# EAGLE design EPS32THINGY (EAGLE 9.5.2)
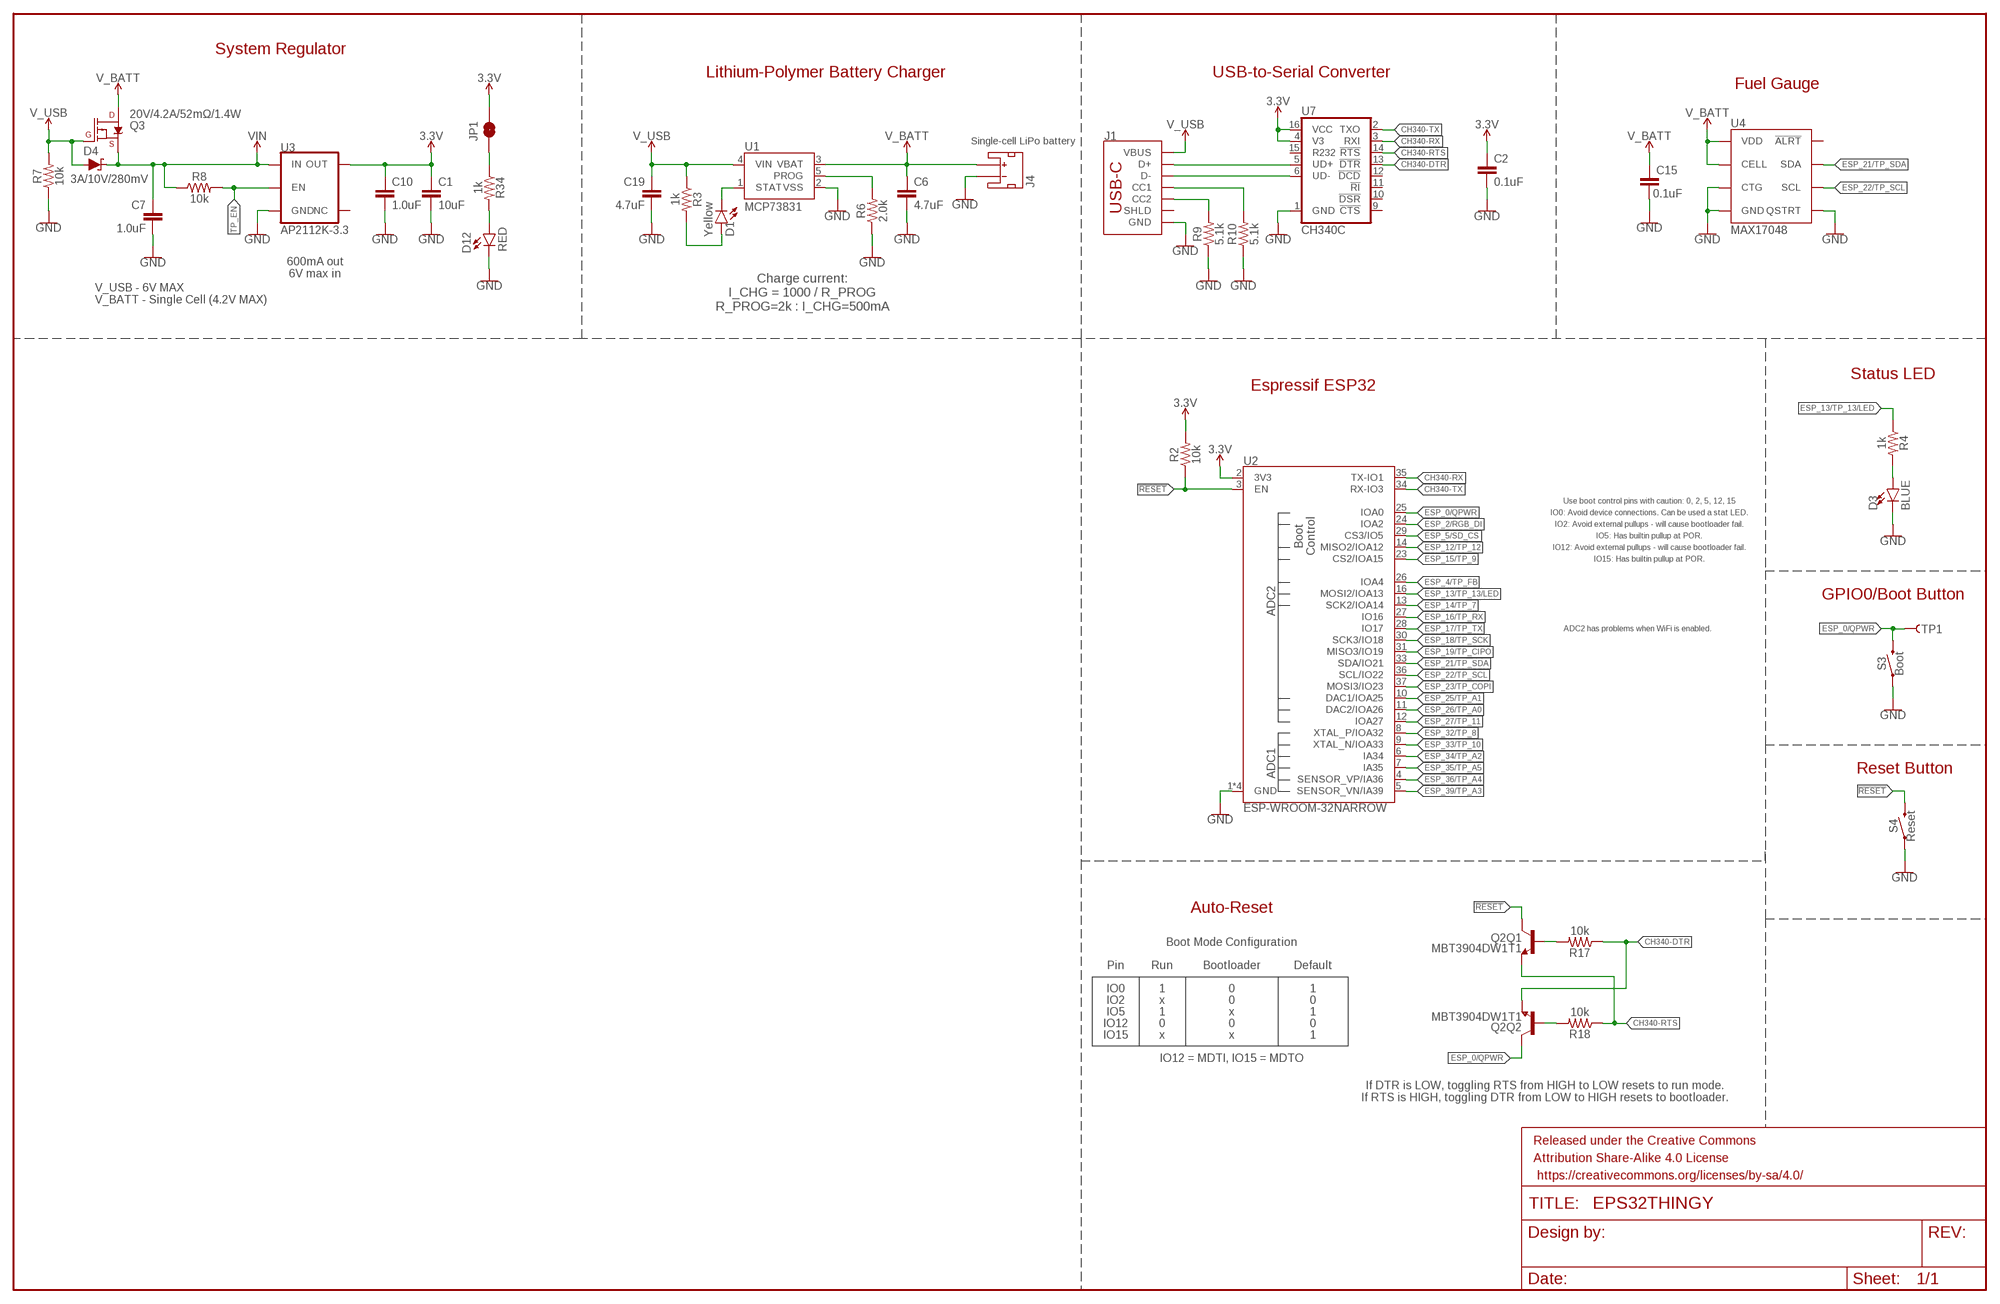
[diagram p0: schematic, sheet 1]

## Parts
C1  10uF  10UF-0402T-6.3V-20%  [0402-TIGHT]
C2  0.1uF  0.1UF-0402T-6.3V-10%-X7R  [0402-TIGHT]
C6  4.7uF  4.7UF-0402_TIGHT-6.3V-20%-X5R  [0402-TIGHT]
C7  1.0uF  1.0UF-0402T-16V-10%  [0402-TIGHT]
C10  1.0uF  1.0UF-0402T-16V-10%  [0402-TIGHT]
C15  0.1uF  0.1UF-0402T-16V-10%  [0402-TIGHT]
C19  4.7uF  4.7UF-0603-35V-(20%)  [0603]
D1  Yellow  LED-YELLOW0603  [LED-0603]
D3  BLUE  LED-BLUE0603  [LED-0603]
D4  3A/10V/280mV  DIODE-SCHOTTKY-BAT60A  [SOD-323]
D12  RED  LED-RED0603  [LED-0603]
FRAME1  FRAME-LEDGER  [CREATIVE_COMMONS]
J1  USB_C_2-LAYER_PADS  [USB-C-16P-2LAYER-PADS]
J4  JST_2MM_MALE  [JST-2-SMD]
JP1  JUMPER-SMT_2_NC_TRACE_SILK  [SMT-JUMPER_2_NC_TRACE_SILK]
Q2  MBT3904DW1T1  TRANS_NPN_DUAL-MBT3904DW1T1  [SC70-6]
Q3  20V/4.2A/52mΩ/1.4W  MOSFET_PCH-DMG2305UX-7  [SOT23-3]
R2  10k  10KOHM-0402T-1/16W-1%  [0402-TIGHT]
R3  1k  1KOHM-0402T-1/16W-1%  [0402-TIGHT]
R4  1k  1KOHM-0402T-1/16W-1%  [0402-TIGHT]
R6  2.0k  2.0KOHM-0603-1/10W-5%  [0603]
R7  10k  10KOHM-0402T-1/16W-1%  [0402-TIGHT]
R8  10k  10KOHM-0402T-1/16W-1%  [0402-TIGHT]
R9  5.1k  5.1KOHM-0402T-1/16W-1%  [0402-TIGHT]
R10  5.1k  5.1KOHM-0402T-1/16W-1%  [0402-TIGHT]
R17  10k  10KOHM-0402T-1/16W-1%  [0402-TIGHT]
R18  10k  10KOHM-0402T-1/16W-1%  [0402-TIGHT]
R34  1k  1KOHM-0402T-1/16W-1%  [0402-TIGHT]
S3  Boot  MOMENTARY-SWITCH-SPST-SMD-4.6X2.8MM  [TACTILE_SWITCH_SMD_4.6X2.8MM]
S4  Reset  MOMENTARY-SWITCH-SPST-SMD-4.6X2.8MM  [TACTILE_SWITCH_SMD_4.6X2.8MM]
TP1  TEST-POINT3X5  [PAD.03X.05]
U1  MCP73831  [SOT23-5]
U2  ESP-WROOM-32NARROW  [ESP-WROOM-32-NARROW]
U3  AP2112K-3.3  V_REG_AP2112K-3.3V  [SOT23-5]
U4  MAX17048  MAX17048DFN8  [DFN-8]
U7  CH340C  [SO016]

## Nets
3.3V [power]: C1.1 C2.1 C10.1 JP1.2 R2.2 U2.2(3V3) U3.5(OUT) U7.4(V3) U7.16(VCC)
!RESET!: Q2.3(Q1:C) R2.1 S4.3 S4.4 U2.3(EN)
CH340-DTR: Q2.1(Q2:E) R17.1 U7.13(!DTR)
CH340-RTS: Q2.4(Q1:E) R18.1 U7.14(!RTS)
CH340-RX: U2.35(TX-IO1) U7.3(RXI)
CH340-TX: U2.34(RX-IO3) U7.2(TXO)
CHG: D1.C U1.1(STAT)
CHG_LED: D1.A R3.2
D+: J1.A6(D+) J1.B6(D+) U7.5(UD+)
D-: J1.A7(D-) J1.B7(D-) U7.6(UD-)
DTR-10K: Q2.5(Q1:B) R17.2
ESP_0/QPWR: Q2.6(Q2:C) S3.3 S3.4 TP1.P$1 U2.25(IOA0)
ESP_2/RGB_DI: U2.24(IOA2)
ESP_4/TP_FB: U2.26(IOA4)
ESP_5/SD_CS: U2.29(CS3/IO5)
ESP_12/TP_12: U2.14(MISO2/IOA12)
ESP_13/TP_13/LED: R4.1 U2.16(MOSI2/IOA13)
ESP_14/TP_7: U2.13(SCK2/IOA14)
ESP_15/TP_9: U2.23(CS2/IOA15)
ESP_16/TP_RX: U2.27(IO16)
ESP_17/TP_TX: U2.28(IO17)
ESP_18/TP_SCK: U2.30(SCK3/IO18)
ESP_19/TP_CIPO: U2.31(MISO3/IO19)
ESP_21/TP_SDA: U2.33(SDA/IO21) U4.8(SDA)
ESP_22/TP_SCL: U2.36(SCL/IO22) U4.7(SCL)
ESP_23/TP_COPI: U2.37(MOSI3/IO23)
ESP_25/TP_A1: U2.10(DAC1/IOA25)
ESP_26/TP_A0: U2.11(DAC2/IOA26)
ESP_27/TP_11: U2.12(IOA27)
ESP_32/TP_8: U2.8(XTAL_P/IOA32)
ESP_33/TP_10: U2.9(XTAL_N/IOA33)
ESP_34/TP_A2: U2.6(IA34)
ESP_35/TP_A5: U2.7(IA35)
ESP_36/TP_A4: U2.4(SENSOR_VP/IA36)
ESP_39/TP_A3: U2.5(SENSOR_VN/IA39)
GND: C1.2 C2.2 C6.2 C7.2 C10.2 C15.2 C19.2 D3.C D12.C J1.GND J1.GND2(GND) J4.1(-) R6.1 R7.1 R9.1 R10.1 S3.1 S3.2 S4.1 S4.2 U1.2(VSS) U2.1(GND) U2.15(GND) U2.38(GND) U2.GND U3.2(GND) U4.1(CTG) U4.4(GND) U4.6(QSTRT) U4.9(GND) U7.1(GND)
N$1: JP1.1 R34.1
N$2: D3.A R4.2
N$5: J1.B5(CC2) R9.2
N$6: J1.A5(CC1) R10.2
N$14: R6.2 U1.5(PROG)
N$30: D12.A R34.2
RTS-10K: Q2.2(Q2:B) R18.2
TP_EN: R8.2 U3.3(EN)
V_BATT [power]: C6.1 C15.1 J4.2(+) Q3.3(D) U1.3(VBAT) U4.2(CELL) U4.3(VDD)
V_USB [power]: C19.1 D4.A J1.VBUS1(VBUS) J1.VBUS2(VBUS) Q3.1(G) R3.1 R7.2 U1.4(VIN)
VIN [power]: C7.1 D4.C Q3.2(S) R8.1 U3.1(IN)
Unconnected: J1.SHLD1(SHLD) J1.SHLD2(SHLD) J1.SHLD3(SHLD) J1.SHLD4(SHLD) J4.NC1(PAD1) J4.NC2(PAD2) U3.4(NC) U4.5(!ALRT) U7.9(!CTS) U7.10(!DSR) U7.11(!RI) U7.12(!DCD) U7.15(R232)

## Notes on the sheet
- System Regulator
- Lithium-Polymer Battery Charger | USB-to-Serial Converter
- Fuel Gauge
- Single-cell LiPo battery
- 600mA out
  6V max in
- Charge current:
  I_CHG = 1000 / R_PROG
  R_PROG=2k : I_CHG=500mA
- V_USB - 6V MAX
  V_BATT - Single Cell (4.2V MAX)
- Status LED
- Espressif ESP32
- Use boot control pins with caution: 0, 2, 5, 12, 15
- IO0: Avoid device connections. Can be used a stat LED.
- IO2: Avoid external pullups - will cause bootloader fail.
- IO5: Has builtin pullup at POR.
- IO12: Avoid external pullups - will cause bootloader fail.
- IO15: Has builtin pullup at POR.
- GPIO0/Boot Button
- ADC2 has problems when WiFi is enabled.
- Reset Button
- Auto-Reset
- Boot Mode Configuration
- Pin | Run | Bootloader | Default
- IO0 | 1 | 0 | 1
- IO2 | x | 0 | 0
- IO5 | 1 | x | 1
- IO12 | 0 | 0 | 0
- IO15 | x | x | 1
- IO12 = MDTI, IO15 = MDTO
- If DTR is LOW, toggling RTS from HIGH to LOW resets to run mode.
  If RTS is HIGH, toggling DTR from LOW to HIGH resets to bootloader.

## Library data of the parts
C1 = SparkFun-Capacitors:10UF: 10.0µF ceramic capacitors A capacitor is a passive two-terminal electrical component used to store electrical energy temporarily in an electric field.; PROD_ID: CAP-14848
C2 = SparkFun-Capacitors:0.1UF: 0.1µF ceramic capacitors A capacitor is a passive two-terminal electrical component used to store electrical energy temporarily in an electric field.; PROD_ID: CAP-14993
C6 = SparkFun-Capacitors:4.7UF: 4.7µF ceramic capacitors A capacitor is a passive two-terminal electrical component used to store electrical energy temporarily in an electric field.; PROD_ID: CAP-14240
C7 C10 = SparkFun-Capacitors:1.0UF: 1µF ceramic capacitors A capacitor is a passive two-terminal electrical component used to store electrical energy temporarily in an electric field.; PROD_ID: CAP-12417
C15 = SparkFun-Capacitors:0.1UF: 0.1µF ceramic capacitors A capacitor is a passive two-terminal electrical component used to store electrical energy temporarily in an electric field.; PROD_ID: CAP-12416
C19 = SparkFun-Capacitors:4.7UF: 4.7µF ceramic capacitors A capacitor is a passive two-terminal electrical component used to store electrical energy temporarily in an electric field.; PROD_ID: CAP-14106
D1 = SparkFun-LED:LED-YELLOW: Yellow SMD LED Used in manufacturing several products at SparkFun. Packages: 0603 - SMD 0603 package[Product Link] <http://www.kingbrightusa.com/product.asp?catalog_name=LED&product_id=APT1608SYCK> 0603 -SMART - SMART SMD 0603 package (more efficient/more expensive) [Product Link] <http://www.osram-os.com/osram_os/en/products/product-catalog/led-light-emitting-diodes/smartled-0603/ly-l29k/index.jsp> LilyPad - SMD1206 package[Product Datasheet] <https://www.sparkfun.com/datasheets/DevTools/LilyPad/Q150YUS4.pdf> SparkFun Products: Blynk Board <https://www.sparkfun.com/products/13794> IOIO-OTG <https://www.sparkfun.com/products/13613> XBee Explorer Serial <https://www.sparkfun.com/products/13225>; PROD_ID: DIO-09003
D3 = SparkFun-LED:LED-BLUE: Blue SMD LED Used in manufacturing of various products at SparkFun Packages: 0603 - SMD 0603 package [Product Link] <http://www.digikey.com/product-detail/en/SMLE12BC7TT86/511-1589-2-ND/1641808> 1206 - SMD1206 package [Product Link] <http://www.digikey.com/product-detail/en/lite-on-inc/LTST-C150TBKT/160-1643-1-ND/573584> SparkFun Products: ESP8266 Thing-Dev Board <https://www.sparkfun.com/products/13711> RedBoard <https://www.sparkfun.com/products/12757>; PROD_ID: DIO-08575
D4 = SparkFun-DiscreteSemi:DIODE-SCHOTTKY: Schottky diode A Schottky diode is a semiconductor diode which has a low forward voltage drop and a very fast switching action.; PROD_ID: DIO-14072
D12 = SparkFun-LED:LED-RED: Red SMD LED Used in manufacturing of most products at SparkFun Packages: 0603 - SMD 0603 package [Product Link] <http://docs.avagotech.com/docs/AV02-0551EN> 0603 SMART - SMD 0603 SMART package ( more efficient and expensive)[Product Link] <http://www.osram-os.com/Graphics/XPic2/00077099_0.pdf> 1206 - SMD1206 package [Product Link] <https://www.sparkfun.com/datasheets/DevTools/LilyPad/Q150OVS4.pdff> SparkFun Products: Pro Mini 328 -5V <https://www.sparkfun.com/products/821> RedBoard <https://www.sparkfun.com/products/12757> IOIO-OTG <https://www.sparkfun.com/products/13613>; PROD_ID: DIO-00819
FRAME1 = SparkFun-Aesthetics:FRAME-LEDGER: Schematic Frame - Ledger Standard 11x14 US Ledger frame
J1 = SparkFun-Connectors:USB_C: USB Type C 16Pin Connector Super Speed pins not available on the 16-pin purely SMD connector so this part is best for USB 2.0 implementations. D1 and D2 are tied together enabling D+/- no matter which way the cable is plugged into the connector. The two channel configuration pins (CC1/2) are exposed. These are normally connected to ground via 5.1k resistors but can be reconfigured for high current/high power applications. **4-LAYER BOARD WARNING!!** If designing 4-layer board, make sure to select the variant _4-LAYER-ISOLATED. The linked footprint (USB-C-16-4LAYER-ISOLATED) includes some very necessary cutout polygons in the inner layers (2 and 15). This prevents the PTH mounting shield legs on the USB connector from electrically connecting any other polygons on the inner layers (usually VCC and GND).; PROD_ID: CONN-14122
J4 = SparkFun-Connectors:JST_2MM_MALE: JST 2MM MALE RA CONNECTOR Two pin, compact surface mount connector. Commonly used as a battery input connection point. We really like the solid locking feeling and high current rating on these small connectors. We use these all the time as battery connectors. Mates to single-cell LiPo batteries. Here is the connector we sell at SparkFun: JST Right Angle Connector - White <https://www.sparkfun.com/products/8612> (PRT-08612) Datasheet <http://www.sparkfun.com/datasheets/Prototyping/Connectors/JST-Horizontal.pdf> It was used on these SparkFun products: SparkFun MOSFET Power Controller <https://www.sparkfun.com/products/11214> (PRT-11214) SparkFun Battery Babysitter - LiPo Battery Manager <https://www.sparkfun.com/products/13777> (PRT-13777) And many, many others that required a lipo battery connection.; PROD_ID: CONN-11443; SF_ID: PRT-08612
JP1 = SparkFun-Jumpers:JUMPER-SMT_2_NC_TRACE: Normally closed trace jumper This jumper has a trace between two pads so it's normally closed (NC). Use a razor knife to open the connection. For best results follow the IPC guidelines for cutting traces: Cutout at least 0.063 mm (0.005 in). Remove all loose material to clean up the cut area. Seal the cut with an approved epoxy. Reapply solder to reclose the connection.
Q2 = SparkFun-DiscreteSemi:TRANS_NPN_DUAL: Dual NPN Transistors in Single Package The MBT3904W1 puts two general purpose 3904 NPN transistors in a single package. Datasheet <http://www.onsemi.com/pub_link/Collateral/MBT3904DW1T1-D.PDF> SparkFun Products: SparkFun ESP32 Thing <https://www.sparkfun.com/products/13907>; PROD_ID: TRANS-13337
Q3 = SparkFun-DiscreteSemi:MOSFET_PCH: P-channel MOSFETs Voltage controlled devices that allow control of high current outputs. SparkFun Products: SparkFun ESP32 Thing <https://www.sparkfun.com/products/13907> SparkFun ESP8266 Thing <https://www.sparkfun.com/products/13231> SparkFun Pi Servo HAT V2 <https://www.sparkfun.com/products/15316> DMG2305UX-7 (20V/4.2A/SOT23-3); PROD_ID: TRAN-14388
R2 R7 R8 R17 R18 = SparkFun-Resistors:10KOHM: 10kΩ resistor A resistor is a passive two-terminal electrical component that implements electrical resistance as a circuit element. Resistors act to reduce current flow, and, at the same time, act to lower voltage levels within circuits. - Wikipedia; PROD_ID: RES-14241
R3 R4 R34 = SparkFun-Resistors:1KOHM: 1kΩ resistor A resistor is a passive two-terminal electrical component that implements electrical resistance as a circuit element. Resistors act to reduce current flow, and, at the same time, act to lower voltage levels within circuits. - Wikipedia; PROD_ID: RES-14342
R6 = SparkFun-Resistors:2.0KOHM: 2kΩ resistor A resistor is a passive two-terminal electrical component that implements electrical resistance as a circuit element. Resistors act to reduce current flow, and, at the same time, act to lower voltage levels within circuits. - Wikipedia; PROD_ID: RES-08296
R9 R10 = SparkFun-Resistors:5.1KOHM; PROD_ID: RES-14340
S3 S4 = SparkFun-Switches:MOMENTARY-SWITCH-SPST: Momentary Switch (Pushbutton) - SPST Normally-open (NO) SPST momentary switches (buttons, pushbuttons). Variants PTH-12MM - 12mm square, through-hole Momentary Pushbutton Switch - 12mm Square <https://www.sparkfun.com/products/9190> (COM-09190) PTH-6.0MM, PTH-6.0MM-KIT - 6.0mm square, through-hole Mini Pushbutton Switch <https://www.sparkfun.com/products/97> (COM-00097) KIT package intended for soldering kit's - only one side of pads' copper is exposed. PTH-RIGHT-ANGLE-KIT - Right-angle, through-hole Right Angle Tactile Button <https://www.sparkfun.com/products/10791> - Used on SparkFun BigTime Watch Kit <https://www.sparkfun.com/products/11734> SMD-12MM - 12mm square, surface-mount Tactile Button - SMD (12mm) <https://www.sparkfun.com/products/12993> (COM-12993) Used on SparkFun PicoBoard <https://www.sparkfun.com/products/11888> SMD-4.5MM - 4.5mm Square Trackball Switch Used on SparkFun Blackberry Trackballer Breakout <https://www.sparkfun.com/products/13169> SMD-4.6MMX2.8MM - 4.60mm x 2.80mm, surface mount Used on SparkFun SAMD21 Mini Breakout <https://www.sparkfun.com/products/13664> SMD-5.2MM, SMD-5.2-REDUNDANT - 5.2mm square, surface-mount Mini Pushbutton Switch - SMD <https://www.sparkfun.com/products/8720> (COM-08720) Used on Arduino Pro Mini <https://www.sparkfun.com/products/11114> REDUNDANT package connects both switch circuits together SMD-6.0X3.5MM - 6.0 x 3.5mm, surface mount Momentary Reset Switch SMD <https://www.sparkfun.com/products/8229> (COM-08229) SMD-6.2MM-TALL - 6.2mm square, surface mount Tactile Button - SMD (6mm) <https://www.sparkfun.com/products/12992> Used on SparkFun Digital Sandbox <https://www.sparkfun.com/products/12651> SMD-RIGHT-ANGLE - Right-angle, surface mount Used on SparkFun Block for Intel® Edison - Arduino <https://www.sparkfun.com/products/13036>; PROD_ID: SWCH-15606
TP1 = SparkFun-Connectors:TEST-POINT: SparkFun Test Points Bare copper test points for troubleshooting or In-Circuit-Testing. These are used by our Production team for verifying production board runs using pogo-pins on test beds. SparkFun Products: SparkFun LSM9DS1 Breakout <https://www.sparkfun.com/products/13284> SparkFun PSOC <https://www.sparkfun.com/products/13714> SparkFun Load Cell Amplifier <https://www.sparkfun.com/products/13879>
U1 = SparkFun-PowerIC:MCP73831: Miniature single cell, fully integrated Li-Ion, Li-polymer charge management controller http://ww1.microchip.com/downloads/en/DeviceDoc/20001984g.pdf IC-09995; PROD_ID: IC-09995
U2 = SparkFun-RF:ESP-WROOM-32; PROD_ID: IC-13849
U3 = SparkFun-IC-Power:V_REG_AP2112: AP2112 - 600mA CMOS LDO Regulator w/ Enable The AP2112 is CMOS process low dropout linear regulator with enable function, the regulator delivers a guaranteed 600mA (min.) continuous load current. Features Output Voltage Accuracy: ±1.5% Output Current: 600mA (Min.) Foldback Short Current Protection: 50mA Enable Function to Turn ON/OFF VOUT Low Dropout Voltage (3.3V): 250mV (Typ.) @IOUT=600mA Excellent Load Regulation: 0.2%/A (Typ.) Excellent Line Regulation: 0.02%/V (Typ.) Low Quiescent Current: 55μA (Typ.) Low Standby Current: 0.01μA (Typ.) Low Output Noise: 50μVRMS PSRR: 100Hz -65dB, 1kHz -65dB OTSD Protection Stable with 1.0μF Flexible Cap: Ceramic, Tantalum and Aluminum Electrolytic Operation Temperature Range: -40°C to 85°C ESD: MM 400V, HBM 4000V; PROD_ID: VREG-12457; VALUE: 3.3V
U4 = SparkFun-IC-Power:MAX17048: Micropower 1-Cell Li+ ModelGauge SparkFun Products Qduino Mini <https://www.sparkfun.com/products/13614> (DEV-13614); PROD_ID: IC-12551
U7 = SparkFun-IC-Comms:CH340C; PROD_ID: IC-14038

## Net classes
0 default: width 0.127 mm, drill 0.305 mm
1 power: width 0.305 mm, drill 0.305 mm

## Board
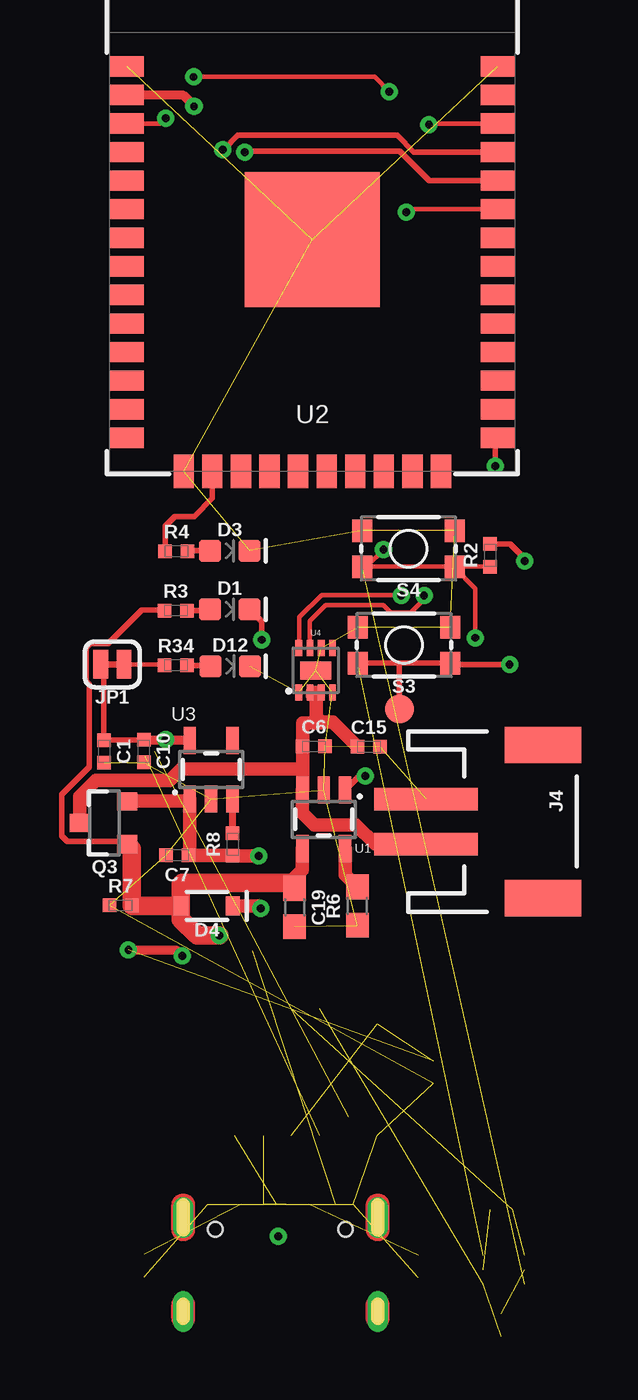
[diagram p1: board, top side]
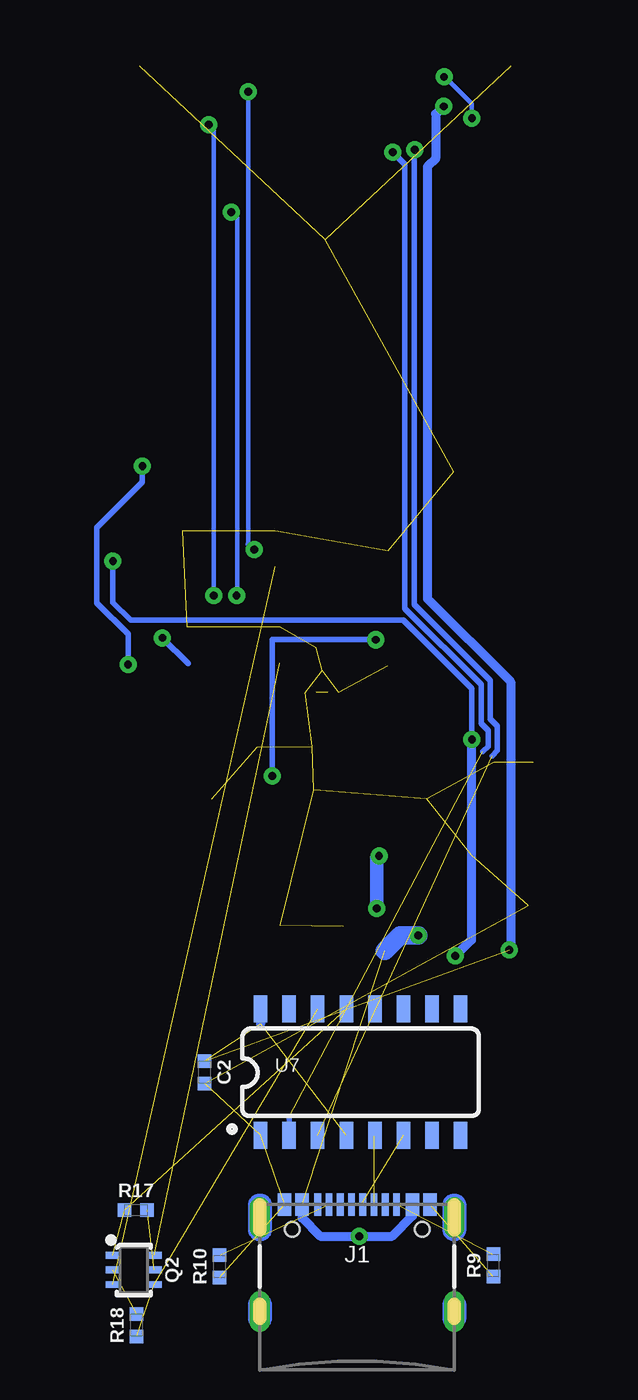
[diagram p2: board, bottom side, seen from below]

No outline drawn. Coordinates in mm, seen from the top.
Copper layers (1*16): Top 0.035mm / dielectric 1.5mm / Bottom 0.035mm
Design rules "LionCircuits *": minimum track width 6mil, minimum drill 0.35mm, track to track 6mil, track to pad 6mil, pad to pad 6mil, via to via 8mil, smd to smd 8mil, copper to edge 30mil, drill to drill 10mil, minimum pad ring 10mil, minimum via ring 8mil, stop-mask expansion 4mil, vias tented up to drill 0mil, thermal gap 10mil

### Footprints (pad centres in the part's own frame; a part is rotated, then mirrored left to right if it is on the bottom)
0402-TIGHT = smd 0.6 x 0.6: 1 -0.5,0; 2 0.5,0
0603 = smd 1.1 x 1: 1 -0.85,0; 2 0.85,0
LED-0603 = smd 1 x 1: A -0.877,0; C 0.877,0
SOD-323 = smd 0.63 x 0.83: A 1.15,0; C -1.15,0
USB-C-16P-2LAYER-PADS = smd 0.3 x 1: A5 -1.25,-0.34; A6 -0.25,-0.34; A7 0.25,-0.34; A8 1.25,-0.34; B5 1.75,-0.34; B6 0.75,-0.34; B7 -0.75,-0.34; B8 -1.75,-0.34 | smd 0.6 x 1: GND -3.225,-0.34; GND2 3.225,-0.34; VBUS1 -2.45,-0.34; VBUS2 2.45,-0.34 | drill 0.4 pad 0.6 long: SHLD1 -4.318,-0.915; SHLD2 4.318,-0.915; SHLD3 -4.318,-5.095; SHLD4 4.318,-5.095 | hole 0.65: -2.89,-1.445; 2.89,-1.445
JST-2-SMD = smd 1 x 4.6: 1 -1,-3.7; 2 1,-3.7 | smd 1.6 x 3.4: NC1 -3.4,1.5; NC2 3.4,1.5
SMT-JUMPER_2_NC_TRACE_SILK = smd 0.66 x 1.27: 1 -0.521,0; 2 0.521,0
SC70-6 = smd 0.3 x 0.66: 1 -0.65,-0.92; 2 0,-0.92; 3 0.65,-0.92; 4 0.65,0.92; 5 0,0.92; 6 -0.65,0.92
SOT23-3 = smd 0.8 x 0.9: 1 -0.95,-1; 2 0.95,-1; 3 0,1.1
TACTILE_SWITCH_SMD_4.6X2.8MM = smd 0.9 x 1: 1 -2.05,-0.8; 2 2.05,-0.8; 3 2.05,0.8; 4 -2.05,0.8
PAD.03X.05 = smd 1.27 x 1.27: P$1 0,0
SOT23-5 = smd 0.55 x 1.2: 1 -0.95,-1.3; 2 0,-1.3; 3 0.95,-1.3; 4 0.95,1.3; 5 -0.95,1.3
ESP-WROOM-32-NARROW = smd 0.9 x 1.5: 1 6.43,8.238; 2 5.16,8.238; 3 3.89,8.238; 4 2.62,8.238; 5 1.35,8.238; 6 0.08,8.238; 7 -1.19,8.238; 8 -2.46,8.238; 9 -3.73,8.238; 10 -5,8.238; 11 -6.27,8.238; 12 -7.54,8.238; 13 -8.81,8.238; 14 -10.08,8.238; 25 -10.08,-8.238; 26 -8.81,-8.238; 27 -7.54,-8.238; 28 -6.27,-8.238; 29 -5,-8.238; 30 -3.73,-8.238; 31 -2.46,-8.238; 32 -1.19,-8.238; 33 0.08,-8.238; 34 1.35,-8.238; 35 2.62,-8.238; 36 3.89,-8.238; 37 5.16,-8.238; 38 6.43,-8.238 | smd 1.5 x 0.9: 15 -11.57,5.715; 16 -11.57,4.445; 17 -11.57,3.175; 18 -11.57,1.905; 19 -11.57,0.635; 20 -11.57,-0.635; 21 -11.57,-1.905; 22 -11.57,-3.175; 23 -11.57,-4.445; 24 -11.57,-5.715 | smd 6 x 6: GND -1.27,0
DFN-8 = smd 0.3 x 0.7: 1 -0.75,-0.99; 2 -0.25,-0.99; 3 0.25,-0.99; 4 0.75,-0.99; 5 0.75,0.99; 6 0.25,0.99; 7 -0.25,0.99; 8 -0.75,0.99 | smd 1.38 x 0.8: 9 0,0
SO016 = smd 0.6 x 1.2: 1 -4.445,-2.8; 2 -3.175,-2.8; 3 -1.905,-2.8; 4 -0.635,-2.8; 5 0.635,-2.8; 6 1.905,-2.8; 7 3.175,-2.8; 8 4.445,-2.8; 9 4.445,2.8; 10 3.175,2.8; 11 1.905,2.8; 12 0.635,2.8; 13 -0.635,2.8; 14 -1.905,2.8; 15 -3.175,2.8; 16 -4.445,2.8

### Placement (x,y rotation side)
C1  166.14,42.33 270 top
C2  180.75,28.07 270 bottom
C6  175.46,42.55 0 top
C7  169.38,37.71 180 top
C10  167.9,42.34 270 top
C15  177.9,42.53 0 top
C19  174.6,35.39 270 top
D1  171.72,48.64 0 top
D3  171.72,51.24 0 top
D4  170.7,35.46 180 top
D12  171.74,46.11 0 top
FRAME1  30.28,-130.17 0 top
J1  173.97,22.53 0 bottom
J4  184.14,39.2 270 top
JP1  166.5,46.19 180 top
Q2  183.9,19.28 270 bottom
Q3  166.16,39.15 90 top
R2  183.29,51.04 90 top
R3  169.32,48.58 0 top
R4  169.35,51.22 0 top
R6  177.39,35.45 90 top
R7  166.87,35.48 0 top
R8  171.85,38.2 90 top
R9  167.92,19.48 90 bottom
R10  180.09,19.43 90 bottom
R17  183.8,21.94 0 bottom
R18  183.77,16.82 90 bottom
R34  169.32,46.15 0 top
S3  179.46,47.05 180 top
S4  179.66,51.33 180 top
TP1  179.26,44.21 180 top
U1  175.9,39.31 180 top
U2  175.39,66.34 90 top
U3  170.89,41.52 0 top
U4  175.53,45.93 0 top
U7  173.82,28.07 0 bottom

### Tracks (layer width: path | path; a pad name or v marks a point on that pad's centre or on a via)
3.3V  (via drill 0.35)  (3 unrouted)
  Top 0.254: JP1.2 166.13,46.04 166.13,42.84 | C1.1 C10.1 | R2.2 184.18,51.54 184.88,50.84
  Top 0.406: 166.13,42.84 C1.1 | C10.1 169.92,42.84 U3.5 168.9,42.82 v168.87,42.85 | 184.88,50.84 v184.82,50.79 | U2.2 169.62,71.5 v170.13,70.99 | v167.22,33.5 169.34,33.5 v169.61,33.23
  Bottom 0.254: v184.82,50.79 184.82,48.95 184.04,48.17 171.93,48.17 168.88,45.12 v168.88,42.86
  Bottom 0.406: v169.61,33.23 168.9,33.94 168.9,42.82 v168.87,42.85 v168.88,42.86 | U7.16 178.26,30.23 | 170.15,70.99 170.49,70.65 170.49,68.67 170.85,68.31 170.85,49.12 167.16,45.42 167.16,33.56
  Bottom 0.61: v170.13,70.99 170.15,70.99 | 167.16,33.56 v167.22,33.5
!RESET!  (via drill 0.35)  (1 unrouted)
  Top 0.203: S4.3 181.66,50.53 182.62,49.57 v182.62,47.37 | S4.4 R2.1 | U2.3 168.64,70.23 v168.87,70.46 | v170.11,72.3 178.16,72.3 v178.81,71.65 | v178.55,51.29 177.79,50.53
  Top 0.254: 181.66,50.53 S4.4 | R2.1 | 177.79,50.53 S4.3
  Bottom 0.203: v168.87,70.46 168.87,71.1 170.07,72.3 | v178.81,71.65 178.81,51.55
  Bottom 0.254: 181.49,46.24 v182.62,47.37 | 170.07,72.3 v170.11,72.3 | 178.81,51.55 v178.55,51.29
CH340-DTR  (2 unrouted)
CH340-RTS  (2 unrouted)
CH340-RX  (via drill 0.35)  (1 unrouted)
  Top 0.254: U2.35 179.9,68.96 179.16,69.7 172.08,69.7 171.45,69.07 v171.41,69.07
  Bottom 0.254: 167.97,42.13 167.75,42.35 167.75,43.45 168.06,43.75 168.06,45.47 171.44,48.85 171.44,69.04 v171.41,69.07
  Bottom 0.406: v171.41,69.07 171.38,69.09 | 175.71,25.29 U7.3
CH340-TX  (via drill 0.35)  (1 unrouted)
  Top 0.254: U2.34 180.58,67.69 179.27,69 172.43,69
  Top 0.406: 172.43,69 v172.39,68.96
  Bottom 0.254: v172.39,68.96 171.85,68.42 171.85,48.68 168.47,45.3 168.47,43.56 168.16,43.25 168.16,42.55 168.39,42.31 | 177,26.09 U7.2
CHG  (via drill 0.35)
  Top 0.254: U1.1 177.47,41.23 v177.74,41.23 | v173.14,47.29 173.14,48.1 D1.C
  Bottom 0.254: v177.74,41.23 177.74,47.29 173.65,47.29 v173.14,47.29
CHG_LED
  Top 0.254: R3.2 170.78,48.58
  Top 0.305: 170.78,48.58 D1.A
D+  (2 unrouted)
  Bottom 0.203: 173.22,25.23 U7.5
D-  (2 unrouted)
  Bottom 0.203: 173.76,22.23 J1.A7
DTR-10K  (1 unrouted)
ESP_0/QPWR  (via drill 0.35)  (1 unrouted)
  Top 0.254: S3.3 179.23,46.25 | 179.23,46.25 S3.4 181.57,46.19 v184.15,46.19 | 179.23,46.25 179.26,46.22 TP1.P$1 | v183.51,55.01 183.51,56.14 U2.25
  Bottom 0.254: v184.15,46.19 184.15,47.53 185.54,48.92 185.54,52.26 183.51,54.29 v183.51,55.01
ESP_13/TP_13/LED
  Top 0.254: U2.16 170.94,53.58 170.14,52.77 169.28,52.77 168.85,52.34 R4.1
ESP_21/TP_SDA  (via drill 0.35)
  Top 0.203: U2.33 179.69,66.42 v179.56,66.29 | 179.31,49.28 175.8,49.28 174.81,48.29 174.81,46.95
  Top 0.305: v179.33,49.26 179.31,49.28 | 174.81,46.95 U4.8
  Bottom 0.203: 179.54,66.29 179.3,66.05 179.3,49.29
  Bottom 0.305: v179.56,66.29 179.54,66.29 | v179.33,49.26 179.3,49.29
ESP_22/TP_SCL  (via drill 0.35)
  Top 0.203: U4.7 175.28,48.11 175.99,48.82 178.55,48.82 178.88,48.49 179.75,48.49 180.35,49.09 | 180.62,70.23 U2.36
  Top 0.305: 180.35,49.09 v180.35,49.25 | v180.57,70.18 180.62,70.23
  Bottom 0.203: v180.35,49.25 180.35,69.96 v180.57,70.18
GND  (30 unrouted)
N$1
  Top 0.203: JP1.1 168.78,46.19
  Top 0.305: 168.78,46.19 R34.1
N$2
  Top 0.254: D3.A 169.87,51.24 R4.2
N$5  (1 unrouted)
N$6  (1 unrouted)
N$14
  Top 0.61: R6.2 176.85,36.84 U1.5
N$30
  Top 0.254: R34.2 170.82,46.15
  Top 0.305: 170.82,46.15 D12.A
RTS-10K  (1 unrouted)
TP_EN
  Top 0.305: U3.3 R8.2
V_BATT  (2 unrouted)
  Top 0.61: C15.1 176.29,43.64 175.78,43.64 | 174.96,41.54 C6.1 174.96,43.59 175.73,43.59 175.78,43.64 | 174.96,41.54 U1.3 174.95,39.58 175.47,39.06 177.31,39.06 178.18,38.2 J4.2 | Q3.3 165.06,40.32 165.76,41.02 169.05,41.02 169.57,41.54 174.96,41.54 | 175.78,43.64 175.56,43.86 175.56,44.66 175.39,44.83 175.39,44.94 175.67,44.94
V_USB  (via drill 0.35)  (1 unrouted)
  Top 0.254: 167.03,38.33 164.5,38.33 164.26,38.56 164.26,40.42 165.47,41.62 165.47,45.3 165.34,45.43 165.34,46.95 165.52,47.13 166.33,47.13 167.81,48.61 168.79,48.61
  Top 0.305: Q3.1 167.03,38.33 | 168.79,48.61 R3.1
  Top 0.61: U1.4 174.95,37.05 174.37,36.47
  Top 0.813: D4.A 169.55,34.86 170.27,34.14 v171.25,34.14 | D4.A 167.39,35.46 R7.2 167.37,37.99 Q3.1 | D4.A 169.55,36.42 169.6,36.47 174.37,36.47 C19.1
  Bottom 0.406: J1.VBUS1 176.42,21.59 175.61,20.78 v173.87,20.78 172.42,20.78 171.52,21.68 J1.VBUS2
  Bottom 0.813: 172.74,33.46 172.06,34.14 v171.25,34.14
VIN  (via drill 0.35)
  Top 0.61: Q3.2 167.18,40.12 169.84,40.12 U3.1 169.94,37.77 C7.1 171.84,37.71 R8.1 171.87,37.68 v173,37.68 | D4.C 172.98,35.46 v173.1,35.34
  Bottom 0.61: v173.1,35.34 173.1,37.58 v173,37.68